# Altium schematic sheet Page08 CPU MISC.SchDoc
size 350 x 209 mm
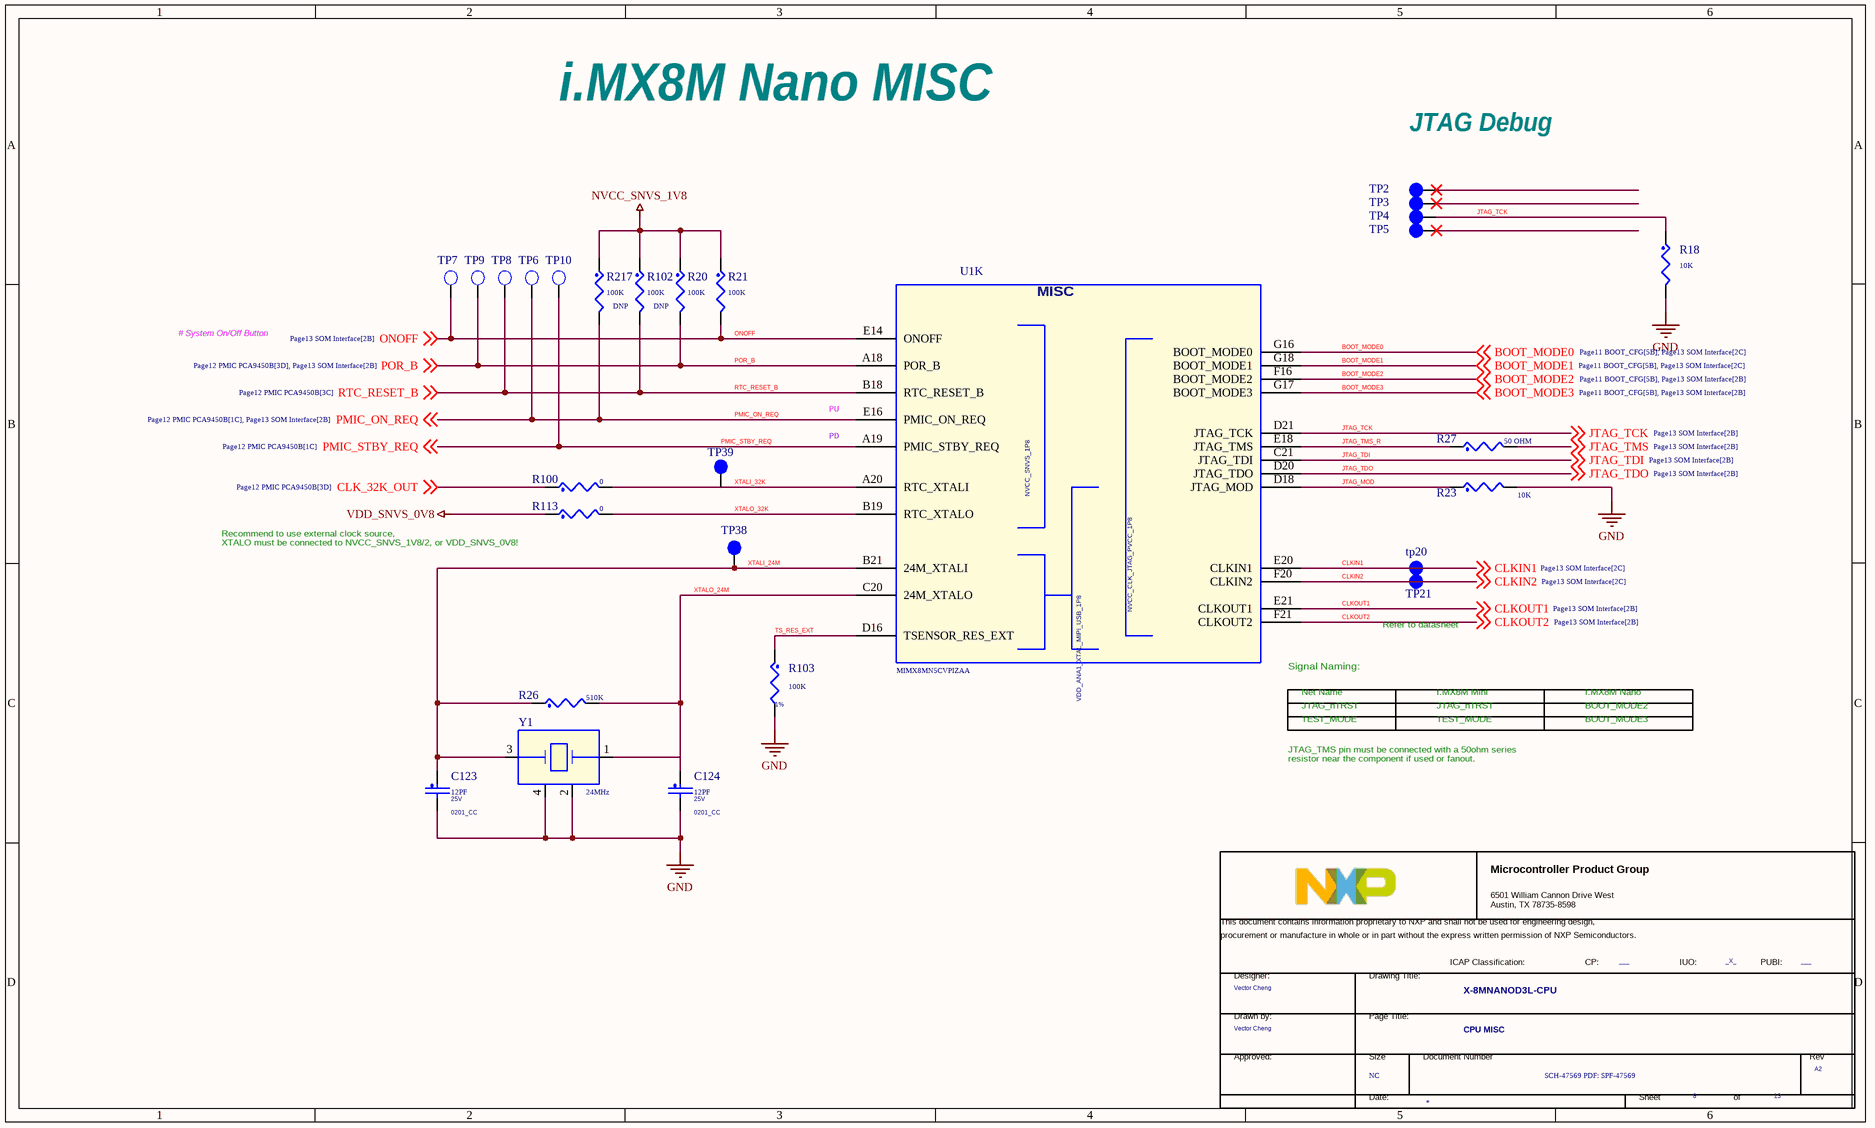
[diagram p0: Page08 CPU MISC.SchDoc]

## Parts
*  FCP: ___  FIUO: _X_  DrawnBy: Vector Cheng  PageTitle: CPU MISC  Page Count: 13  Page Number: 8  Page Size: NC  Title: X-8MNANOD3L-CPU  RevCode: A2  Doc: SCH-47569 PDF: SPF-47569  (hidden comment: TitleBlock_MCPG)  (graphical)
C123  12PF  VOLTAGE: 25V  PCB Footprint: 0201_CC  [0201_CC - C]
C124  12PF  VOLTAGE: 25V  PCB Footprint: 0201_CC  [0201_CC - C]
R18  10K  [0201_RES]
R20  100K  [0201_RES]
R21  100K  [0201_RES]
R23  10K  [0201_RES]
R26  510K  [0402_CC]
R27  50 OHM  [0402_CC]
R100  0  [0402_CC]
R102  100K  ASSY_OPT: DNP  [0201_RES]
R103  100K  Tolerance: 1%  [0201_RES]
R113  0  [0402_CC]
R217  100K  ASSY_OPT: DNP  [0201_RES]
TP2  tpad_020  [tpad_020]  (value not drawn)
TP3  tpad_020  [tpad_020]  (value not drawn)
TP4  tpad_020  [tpad_020]  (value not drawn)
TP5  tpad_020  [tpad_020]  (value not drawn)
TP6  TP_35MIL  [testpoint_35mil]  (value not drawn)
TP7  TP_35MIL  [testpoint_35mil]  (value not drawn)
TP8  TP_35MIL  [testpoint_35mil]  (value not drawn)
TP9  TP_35MIL  [testpoint_35mil]  (value not drawn)
TP10  TP_35MIL  [testpoint_35mil]  (value not drawn)
tp20  tpad_020  [tpad_020]  (value not drawn)
TP21  tpad_020  [tpad_020]  (value not drawn)
TP38  tpad_020  [tpad_020]  (value not drawn)
TP39  tpad_020  [tpad_020]  (value not drawn)
U1  MIMX8MN5CVPIZAA  [BGA306C50P21X21_1100X1100X101]  (part K of 12)
Y1  24MHz  [OSCCC320X250X60]

## Nets
GND: C123.2 C124.2 R18.2 R23.2 R103.2 Y1.2 Y1.4
NVCC_SNVS_1V8: R20.1 R21.1 R102.1 R217.1
VDD_SNVS_0V8: R113.1
BOOT_MODE0: U1.G16(BOOT_MODE0) ; off-sheet BOOT_MODE0
BOOT_MODE1: U1.G18(BOOT_MODE1) ; off-sheet BOOT_MODE1
BOOT_MODE2: U1.F16(BOOT_MODE2) ; off-sheet BOOT_MODE2
BOOT_MODE3: U1.G17(BOOT_MODE3) ; off-sheet BOOT_MODE3
CLK_32K_OUT: R100.1 ; off-sheet CLK_32K_OUT
CLKIN1: tp20.1(Pin1) U1.E20(CLKIN1) ; off-sheet CLKIN1
CLKIN2: TP21.1(Pin1) U1.F20(CLKIN2) ; off-sheet CLKIN2
CLKOUT1: U1.E21(CLKOUT1) ; off-sheet CLKOUT1
CLKOUT2: U1.F21(CLKOUT2) ; off-sheet CLKOUT2
JTAG_MOD: R23.1 U1.D18(JTAG_MOD)
JTAG_TCK: R18.1 TP4.1(Pin1) U1.D21(JTAG_TCK) ; off-sheet JTAG_TCK
JTAG_TDI: U1.C21(JTAG_TDI) ; off-sheet JTAG_TDI
JTAG_TDO: U1.D20(JTAG_TDO) ; off-sheet JTAG_TDO
JTAG_TMS: R27.2 ; off-sheet JTAG_TMS
JTAG_TMS_R: R27.1 U1.E18(JTAG_TMS)
ONOFF: R21.2 TP7.1(TP) U1.E14(ONOFF) ; off-sheet ONOFF
PMIC_ON_REQ: R217.2 TP6.1(TP) U1.E16(PMIC_ON_REQ) ; off-sheet PMIC_ON_REQ
PMIC_STBY_REQ: TP10.1(TP) U1.A19(PMIC_STBY_REQ) ; off-sheet PMIC_STBY_REQ
POR_B: R20.2 TP9.1(TP) U1.A18(POR_B) ; off-sheet POR_B
RTC_RESET_B: R102.2 TP8.1(TP) U1.B18(RTC_RESET_B) ; off-sheet RTC_RESET_B
TS_RES_EXT: R103.1 U1.D16(TSENSOR_RES_EXT)
XTALI_24M: C123.1 R26.1 TP38.1(Pin1) U1.B21(24M_XTALI) Y1.3
XTALI_32K: R100.2 TP39.1(Pin1) U1.A20(RTC_XTALI)
XTALO_24M: C124.1 R26.2 U1.C20(24M_XTALO) Y1.1
XTALO_32K: R113.2 U1.B19(RTC_XTALO)

Not connected (* = marked no-connect by the designer): TP2 1(Pin1)*; TP3 1(Pin1)*; TP5 1(Pin1)*

## Notes on the sheet
- i.MX8M Nano MISC
- JTAG Debug
- # System On/Off Button
- PD
- PU
- Recommend to use external clock source,
  XTALO must be connected to NVCC_SNVS_1V8/2, or VDD_SNVS_0V8!
- (near U1) Signal Naming:
- Refer to datasheet
- TEST_MODE
- JTAG_nTRST
- Net Name
- I.MX8M Mini
- BOOT_MODE2
- I.MX8M Nano
- BOOT_MODE3
- JTAG_TMS pin must be connected with a 50ohm series
  resistor near the component if used or fanout.
- (in symbol MIMX8MN, part K) MISC
- (in symbol TitleBlock_MCPG) Microcontroller Product Group; 6501 William Cannon Drive West / Austin, TX 78735-8598; This document contains information proprietary to NXP and shall not be used for engineering design,; procurement or manufacture in whole or in part without the express written permission of NXP Semiconductors.; ICAP Classification:; CP:; IUO:; PUBI:; Designer:; Drawing Title:; Drawn by:; Page Title:; Approved:; Size; Document Number; Rev; Date:; Sheet; of

## Library data of the parts
* = TitleBlock_MCPG: OrgAddr1: NO. 192 Liangjing Rd. Pudong New Area, ShangHai; OrgName: NXP Semiconductor; PUBI: ___; Designer: Vector Cheng; Page Create Date: March  8, 1995; Page Modify Date: *
C123 = CAP_NP: CAP CER 12PF 25V 5% C0G AEC-Q200 0201; CLASS: DISCRETE; FPLIST: CC0201,CC0201_HD,0201_CC; CAD_APPROVED: Yes; MFG_PN01: CGA1A2C0G1E120J030BA; MFG_NAME01: TDK; AGILE_PN: 150-79813; HEIGHT: 0.33MM; ROHS: Yes; Tolerance: 5%
C124 = CAP_NP: CAP CER 12PF 25V 5% C0G AEC-Q200 0201; CLASS: DISCRETE; AGILE_PN: 150-79813; MFG_NAME01: TDK; MFG_PN01: CGA1A2C0G1E120J030BA; CAD_APPROVED: Yes; FPLIST: CC0201,CC0201_HD,0201_CC; Tolerance: 5%; ROHS: Yes; HEIGHT: 0.33MM
R18 = RES: RES MF 10K 1/20W 5% 0201; CLASS: DISCRETE; PCB Footprint: 0201_CC; AGILE_PN: 470-79719; MFG_NAME01: RALEC ELECTRONIC CORP; MFG_PN01: RTT01103JTH; CAD_APPROVED: Yes; FPLIST: RC0201,0201_CC; Tolerance: 5%; ROHS: Yes; HEIGHT: 0.26 MM
R20 R21 = RES: RES MF 100K 1/20W 1% 0201; CLASS: DISCRETE; PCB Footprint: 0201_CC; AGILE_PN: 470-77704; MFG_NAME01: SKYMOS; MFG_PN01: RC-0201-104FT; CAD_APPROVED: Yes; FPLIST: RC0201,0201_CC; Tolerance: 1%; ROHS: Yes; HEIGHT: 0.26MM
R23 = RES: RES MF 10K 1/20W 5% 0201; CLASS: DISCRETE; AGILE_PN: 470-79719; MFG_NAME01: RALEC ELECTRONIC CORP; MFG_PN01: RTT01103JTH; CAD_APPROVED: Yes; FPLIST: RC0201,0201_CC; PCB Footprint: 0201_CC; Tolerance: 5%; ROHS: Yes; HEIGHT: 0.26 MM
R26 = RES: RES MF 510K 1/16W 5% 0402; CLASS: DISCRETE; FPLIST: RC0402_25,RC0402_HD,0402_CC; CAD_APPROVED: Yes; MFG_PN01: ERJ-2GEJ514X; MFG_NAME01: PANASONIC; AGILE_PN: 470-76166; HEIGHT: 0.4 MM; ROHS: Yes; Tolerance: 5%; PCB Footprint: 0402_CC
R27 = RES: RES MF 50 OHM 1/20W 5% 0402; CLASS: DISCRETE; AGILE_PN: 470-82494; FPLIST: RC0402_25,RC0402_HD,0402_CC; CAD_APPROVED: YES; MFG_NAME01: VISHAY; MFG_PN01: CH0402-50RJNPA; Package Size: 0402 (1005 Metric); HEIGHT: 0.627MM; Tolerance: 5%; ROHS: Yes; PCB Footprint: 0402_CC
R100 R113 = RES: RES MF ZERO OHM 1/16W 5% 0402; CLASS: DISCRETE; FPLIST: RC0402_25,RC0402_HD,RC0402_X2,0402_CC; CAD_APPROVED: Yes; MFG_PN01: RC0402JR-070RL; MFG_NAME01: YAGEO AMERICA; AGILE_PN: 470-75394; HEIGHT: 0.45 MM; ROHS: Yes; Tolerance: 5%; VOLTAGE: 1/16W; PCB Footprint: 0402_CC
R102 = RES: RES MF 100K 1/20W 1% 0201; CLASS: DISCRETE; AGILE_PN: 470-77704; MFG_NAME01: SKYMOS; MFG_PN01: RC-0201-104FT; CAD_APPROVED: Yes; FPLIST: RC0201,0201_CC; PCB Footprint: 0201_CC; Tolerance: 1%; ROHS: Yes; HEIGHT: 0.26MM
R103 R217 = RES: RES MF 100K 1/20W 1% 0201; CLASS: DISCRETE; FPLIST: RC0201,0201_CC; CAD_APPROVED: Yes; MFG_PN01: RC-0201-104FT; MFG_NAME01: SKYMOS; AGILE_PN: 470-77704; PCB Footprint: 0201_CC; HEIGHT: 0.26MM; ROHS: Yes
  R217: Tolerance: 1%
TP2 TP4 tp20 TP21 TP39 = TESTLOOP: TEST POINT PAD 0.5MM DIA SMT, NO PART TO ORDER; ASSY_OPT: DNP; CLASS: IO; CAD_APPROVED: Yes; AGILE_PN: 211-77484; PCB Footprint: tpad_020; HEIGHT: 0.1MM; ROHS: Yes
TP3 TP5 TP38 = TESTLOOP: TEST POINT PAD 0.5MM DIA SMT, NO PART TO ORDER; ASSY_OPT: DNP; CLASS: IO; AGILE_PN: 211-77484; CAD_APPROVED: Yes; PCB Footprint: tpad_020; ROHS: Yes; HEIGHT: 0.1MM
TP6 TP9 = T POINT R: TEST POINT PAD .035 SMT, no part to order; ASSY_OPT: DNP; CLASS: IC; AGILE_PN: 510-75618; CAD_APPROVED: Yes; PCB Footprint: testpoint_35mil; ROHS: Yes; HEIGHT: 0.1MM
TP7 TP8 TP10 = T POINT R: TEST POINT PAD .035 SMT, no part to order; ASSY_OPT: DNP; CLASS: IC; CAD_APPROVED: Yes; AGILE_PN: 510-75618; PCB Footprint: testpoint_35mil; HEIGHT: 0.1MM; ROHS: Yes
U1 = MIMX8MN: IC CPU QUAD CORTEX A53+M7 1.4GHZ -- BGA306; PCB Footprint: pbga306_0p5_sq11mm; MFG_NAME01: NXP SEMICONDUCTORS; Temp Range: -40¡ãC to 105¡ãC; PRE_APN: 330-77152; CAD_APPROVED: Yes; AGILE_PN: TMP-CIP-5098; CLASS: IC; MFG_PN01: MIMX8MN5CVPIZAA; ROHS: Yes; HEIGHT: 1.01MM
Y1 = XTAL_13: XTAL 24MHZ 9pF -- SMT 3.2X2.5MM; CLASS: IC; AGILE_PN: 230-77392; MFG_NAME01: EPSON TOYOCOM CORPORATION; MFG_PN01: TSX-3225 24.0000MF15X-AC3; CAD_APPROVED: Yes; PCB Footprint: xtlosc4_3p2x2p5mm_sm; ROHS: Yes; HEIGHT: 0.60MM